# EasyEDA Pro project ProPrj_HydroNodeStation01_2026-04-19.epro, schematic WIOE5Board
Board Name: Board1; Create Date: 2026-03-25; Page Name: P1; Project Name: HydroNodeStation01; Schematic Name: Schematic1; Update Date: 2026-03-31; Company: EasyEDA.com; Page Size: A4; Version: V1.0
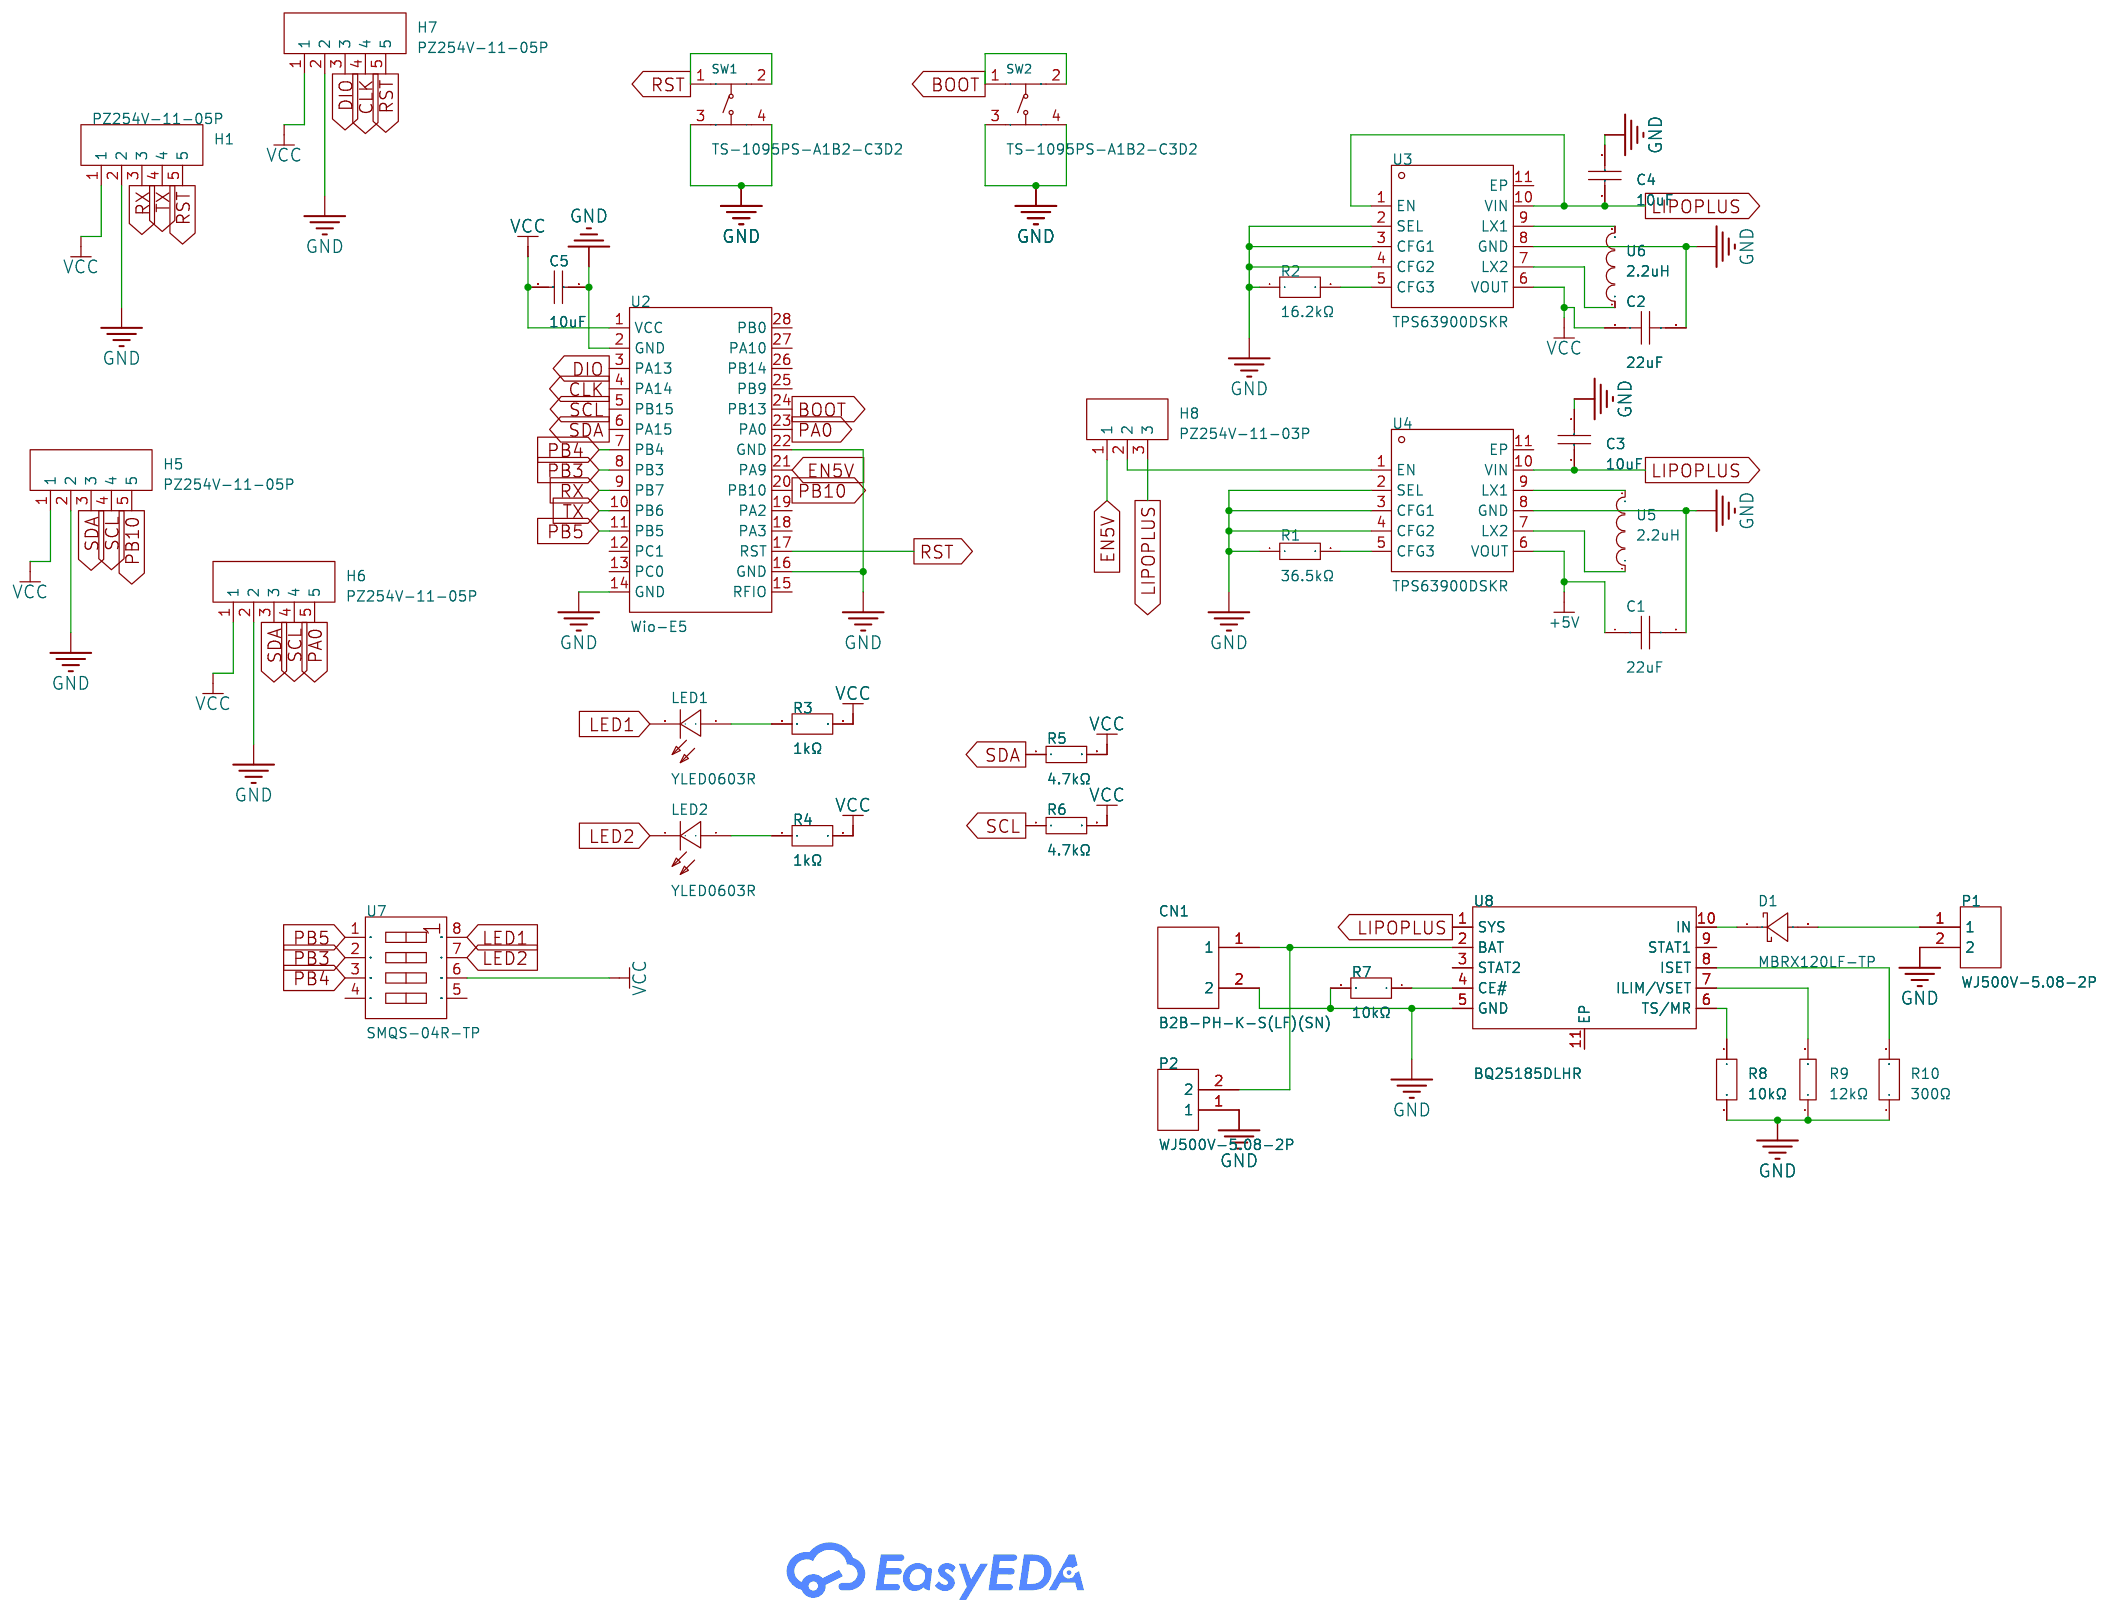
[diagram p1: schematic sheet]

## Parts
C1  22uF  [C0603]
C2  22uF  [C0603]
C3  10uF  [C0402]
C4  10uF  [C0402]
C5  10uF  [C0402]
CN1  B2B-PH-K-S(LF)(SN)  [CONN-TH_B2B-PH-K-S]
D1  MBRX120LF-TP  [SOD-123_L2.7-W1.6-LS3.7-RD]
H1  PZ254V-11-05P  [HDR-TH_5P-P2.54-V-M]
H5  PZ254V-11-05P  [HDR-TH_5P-P2.54-V-M]
H6  PZ254V-11-05P  [HDR-TH_5P-P2.54-V-M]
H7  PZ254V-11-05P  [HDR-TH_5P-P2.54-V-M]
H8  PZ254V-11-03P  [HDR-TH_3P-P2.54-V-M_PZ254V-11-03P]
LED1  YLED0603R  [LED0603-FD]
LED2  YLED0603R  [LED0603-FD]
P1  WJ500V-5.08-2P  [CONN-TH_2P-P5.00_WJ500V-5.08-2P]
P2  WJ500V-5.08-2P  [CONN-TH_2P-P5.00_WJ500V-5.08-2P]
R1  36.5kΩ  [R0402]
R2  16.2kΩ  [R0402]
R3  1kΩ  [R0402]
R4  1kΩ  [R0402]
R5  4.7kΩ  [R0603]
R6  4.7kΩ  [R0603]
R7  10kΩ  [R0805]
R8  10kΩ  [R0805]
R9  12kΩ  [R0402]
R10  300Ω  [R0603]
SW1  TS-1095PS-A1B2-C3D2  [KEY-SMD_4P-L6.0-W6.0-P3.90-LS9.0]
SW2  TS-1095PS-A1B2-C3D2  [KEY-SMD_4P-L6.0-W6.0-P3.90-LS9.0]
U2  Wio-E5  [COMM-SMD_L12.0-W12.0-P1.25_114993120]
U3  TPS63900DSKR  [WSON-10_L2.5-W2.5-W0.50-TL-EP]
U4  TPS63900DSKR  [WSON-10_L2.5-W2.5-W0.50-TL-EP]
U5  2.2uH  [IND-SMD_L3.0-W3.0_LVF303012-4R7M-N]
U6  2.2uH  [IND-SMD_L3.0-W3.0_LVF303012-4R7M-N]
U7  SMQS-04R-TP  [SW-TH_8P-P2.54_SMQS-04R-TP]
U8  BQ25185DLHR  [WSON-10_L2.2-W2.0-P0.40-BL-EP_TI_DLH0010A]

## Library data of the parts
C1 C2 = CL10A226MQ8NRNC: Capacitance:22uF Tolerance:±20% Tolerance:±20% Voltage Rating:6.3V Temperature Coefficient:X5R; LCSC Part Name: 22uF ±20% 6.3V; Supplier Part: C59461; Manufacturer: SAMSUNG(三星); Supplier Footprint: 0603; JLCPCB Part Class: Basic Part; Datasheet: https://item.szlcsc.com/datasheet/CL10A226MQ8NRNC/60514.html; Supplier: LCSC; Tolerance: ±20%; Voltage Rating: 6.3V; Temperature Coefficient: X5R
C3-C5 = CL05A106MQ5NUNC: Capacitance:10uF Tolerance:±20% Tolerance:±20% Voltage Rating:6.3V Temperature Coefficient:X5R; LCSC Part Name: 10uF ±20% 6.3V; Supplier Part: C15525; Manufacturer: SAMSUNG(三星); Supplier Footprint: 0402; JLCPCB Part Class: Basic Part; Datasheet: https://item.szlcsc.com/datasheet/CL05A106MQ5NUNC/16204.html; Supplier: LCSC; Tolerance: ±20%; Voltage Rating: 6.3V; Temperature Coefficient: X5R
CN1 = B2B-PH-K-S(LF)(SN): Pins Structure:1x2P Pitch:2mm Mounting Type:Through Hole Reference Series:PH Number of Pins:2P Number of Rows:1 Number of PINs Per Row:2 Row Spacing:- Current Rating:2A Contact Material:Brass Contact Plating:Tin Operating Temperature:-25℃~+85℃ Operating T; LCSC Part Name: 1x2P 间距:2mm 直插 系列:PH; Supplier Part: C131337; Manufacturer: JST; Supplier Footprint: 插件,P=2mm; JLCPCB Part Class: Extended Part; Datasheet: https://item.szlcsc.com/datasheet/B2B-PH-K-S(LF)(SN)/142630.html; Supplier: LCSC; Pins Structure: 1x2P; Pitch: 2mm; Mounting Type: Through Hole; Reference Series: PH; Number of Pins: 2P; Number of Rows: 1; Number of PINs Per Row: 2; Current Rating: 2A; Contact Material: Brass; Contact Plating: Tin; Operating Temperature: -25℃~+85℃; Voltage Rating: 100V; Plastic Material: PA66; Flame Retardant Rating: UL94V-0; Supplementary Features: K Pin; Color: White; Z-Height of the Board: 6mm; X-Length of Bottom Edge on Board (Spacing Line): 5.9mm; Y-Width of Bottom Edge on Board: 4.5mm
D1 = MBRX120LF-TP: Diode Configuration:- Voltage - Forward(Vf@If):320mV@1A Voltage - DC Reverse(Vr):20V Current - Rectified:1A Reverse Leakage Current (Ir):260uA@5V Operating Junction Temperature Range:-65℃~+125℃ Operating Junction Temperature Range:-65℃~+125℃ Non-Repetitiv; LCSC Part Name: 电压:20V 电流:1A; Supplier Part: C668956; Manufacturer: MCC(美微科); Supplier Footprint: SOD-123; JLCPCB Part Class: Extended Part; Datasheet: https://item.szlcsc.com/datasheet/MBRX120LF-TP/699015.html; Supplier: LCSC; Voltage - Forward(Vf@If): 320mV@1A; Voltage - DC Reverse(Vr): 20V; Current - Rectified: 1A; Reverse Leakage Current (Ir): 260uA@5V; Operating Junction Temperature Range: -65℃~+125℃; Non-Repetitive Peak Forward Surge Current: 12A
H1 H5-H7 = PZ254V-11-05P: Pin Structure:1x5P Pitch:2.54mm Row Spacing:- Circluar Pins/Square Pins:Pin Header Mounting Type:Through Hole Number of Rows:1 Number of Pins:5P Current Rating:3A Voltage Rating (Max):250V Length of Mating Pin:6mm Insulation Height:2.5mm Length of End Con; LCSC Part Name: 1x5P 间距:2.54mm 方针 直插; Supplier Part: C492404; Manufacturer: XFCN(兴飞); Supplier Footprint: 插件,P=2.54mm; JLCPCB Part Class: Extended Part; Datasheet: https://item.szlcsc.com/datasheet/PZ254V-11-05P/502960.html; Supplier: LCSC; Pin Structure: 1x5P; Pitch: 2.54mm; Circluar Pins/Square Pins: Pin Header; Mounting Type: Through Hole; Number of Rows: 1; Number of Pins: 5P; Current Rating: 3A; Voltage Rating (Max): 250V; Length of Mating Pin: 6mm; Insulation Height: 2.5mm; Length of End Connection Pin: 3mm; Contact Material: Brass; Operating Temperature: -40℃~+105℃; Color: Black
H8 = PZ254V-11-03P: Pin Structure:1x3P Pitch:2.54mm Row Spacing:- Circluar Pins/Square Pins:Pin Header Mounting Type:Through Hole Number of Rows:1 Number of Pins:3P Current Rating:3A Voltage Rating (Max):250V Length of Mating Pin:6mm Insulation Height:2.5mm Length of End Con; LCSC Part Name: 1x3P 间距:2.54mm 方针 直插; Supplier Part: C2937625; Manufacturer: XFCN(兴飞); Supplier Footprint: 插件,P=2.54mm; JLCPCB Part Class: Extended Part; Datasheet: https://item.szlcsc.com/datasheet/PZ254V-11-03P/3293280.html; Supplier: LCSC; Pin Structure: 1x3P; Pitch: 2.54mm; Circluar Pins/Square Pins: Pin Header; Mounting Type: Through Hole; Number of Rows: 1; Number of Pins: 3P; Current Rating: 3A; Voltage Rating (Max): 250V; Length of Mating Pin: 6mm; Insulation Height: 2.5mm; Length of End Connection Pin: 3mm; Operating Temperature: -40℃~+105℃; Color: Black
LED1 LED2 = YLED0603R: Lamp Holder Type:-；- Illumination Color:Red Voltage - Forward(Vf):1.8V~2.4V Voltage - Forward(Vf):1.8V~2.4V Power(Watts):- Forward Current:25mA Wavelength - Dominant:620nm~625nm Wavelength - Dominant:620nm~625nm Peak Wavelength:- Diode Configuration:Discr; LCSC Part Name: 红色 独立二极管; Supplier Part: C19171390; Manufacturer: YONGYUTAI(永裕泰); Supplier Footprint: 0603; JLCPCB Part Class: Extended Part; Datasheet: https://item.szlcsc.com/datasheet/YLED0603R/20382441.html; Supplier: LCSC; Lamp Holder Type: -；-; Illumination Color: Red; Voltage - Forward(Vf): 1.8V~2.4V; Forward Current: 25mA; Wavelength - Dominant: 620nm~625nm; Diode Configuration: Discrete Diode; Luminous Intensity: 120mcd; Viewing Angle: 120°; Operating Temperature: -40℃~+85℃
P1 P2 = WJ500V-5.08-2P: Structure:1x2P Pitch:5.08mm Color:Green Mounting Style:Direct Insert Current Rating (Max):18A Voltage Rating (Max):250V Number of Pins:2P Number of Rows:1 Wire Gauge - AWG:14~30 Wire Gauge - AWG:14~30 Wire Gauge - mm2:2.5 Wire Gauge - mm2:2.5 Number of PI; LCSC Part Name: 1x2P 5.08mm 直插 排数:1 每排P数:2; Supplier Part: C8465; Manufacturer: KANGNEX(康奈克斯电气); Supplier Footprint: 插件,P=5.08mm; JLCPCB Part Class: Extended Part; Datasheet: https://atta.szlcsc.com/upload/public/pdf/source/20191225/C8465_02D34CE5B5B4A53DF5891601D97FA9F4.pdf; Supplier: LCSC; Structure: 1x2P; Pitch: 5.08mm; Color: Green; Mounting Style: Direct Insert; Current Rating (Max): 18A; Voltage Rating (Max): 250V; Number of Pins: 2P; Number of Rows: 1; Wire Gauge - AWG: 14~30; Wire Gauge - mm2: 2.5; Number of PINs Per Row: 2; Operating Temperature Range: -40℃~+105℃; Screw Specification: M2.5
R1 = 0402WGF3652TCE: Type:Thick Film Resistor Resistance:36.5kΩ Tolerance:±1% Tolerance:±1% Power(Watts):62.5mW Voltage-Supply(Max):50V Temperature Coefficient:±100ppm/℃ Temperature Coefficient:±100ppm/℃ Operating Temperature:-55℃~+155℃ Operating Temperature:-55℃~+155℃; LCSC Part Name: 36.5kΩ ±1% 62.5mW 厚膜电阻; Supplier Part: C25887; Manufacturer: UNI-ROYAL(厚声); Supplier Footprint: 0402; JLCPCB Part Class: Extended Part; Datasheet: https://item.szlcsc.com/datasheet/0402WGF3652TCE/26630.html; Supplier: LCSC; Type: Thick Film Resistor; Tolerance: ±1%; Power(Watts): 62.5mW; Voltage-Supply(Max): 50V; Temperature Coefficient: ±100ppm/℃; Operating Temperature: -55℃~+155℃
R2 = FRC0402F1622TS: Type:Thick Film Resistor Resistance:16.2kΩ Tolerance:±1% Tolerance:±1% Power(Watts):62.5mW Voltage-Supply(Max):50V Temperature Coefficient:±100ppm/℃ Temperature Coefficient:±100ppm/℃ Operating Temperature:-55℃~+155℃ Operating Temperature:-55℃~+155℃; LCSC Part Name: 厚膜电阻 0402 16.2KΩ ±1% 62.5mW; Supplier Part: C49196904; Manufacturer: FOJAN(富捷); Supplier Footprint: 0402; JLCPCB Part Class: Extended Part; Datasheet: https://item.szlcsc.com/datasheet/FRC0402F1622TS/51599152.html; Supplier: LCSC; Type: Thick Film Resistor; Tolerance: ±1%; Power(Watts): 62.5mW; Voltage-Supply(Max): 50V; Temperature Coefficient: ±100ppm/℃; Operating Temperature: -55℃~+155℃
R3 R4 = FRC0402J102 TS: Type:Thick Film Resistor Resistance:1kΩ Tolerance:±5% Tolerance:±5% Power(Watts):62.5mW Voltage-Supply(Max):50V Temperature Coefficient:±100ppm/℃ Temperature Coefficient:±100ppm/℃ Operating Temperature:-55℃~+155℃ Operating Temperature:-55℃~+155℃; LCSC Part Name: 1kΩ ±5% 62.5mW 厚膜电阻; Supplier Part: C2906899; Manufacturer: FOJAN(富捷); Supplier Footprint: 0402; JLCPCB Part Class: Extended Part; Supplier: LCSC; Type: Thick Film Resistor; Tolerance: ±5%; Power(Watts): 62.5mW; Voltage-Supply(Max): 50V; Temperature Coefficient: ±100ppm/℃; Operating Temperature: -55℃~+155℃
R5 R6 = 0603WAF4701T5E: Type:Thick Film Resistor Resistance:4.7kΩ Tolerance:±1% Tolerance:±1% Power(Watts):100mW Voltage-Supply(Max):75V Temperature Coefficient:±100ppm/℃ Temperature Coefficient:±100ppm/℃ Operating Temperature:-55℃~+155℃ Operating Temperature:-55℃~+155℃; LCSC Part Name: 4.7kΩ ±1% 100mW 厚膜电阻; Supplier Part: C23162; Manufacturer: UNI-ROYAL(厚声); Supplier Footprint: 0603; JLCPCB Part Class: Basic Part; Datasheet: https://item.szlcsc.com/datasheet/0603WAF4701T5E/23889.html; Supplier: LCSC; Type: Thick Film Resistor; Tolerance: ±1%; Power(Watts): 100mW; Voltage-Supply(Max): 75V; Temperature Coefficient: ±100ppm/℃; Operating Temperature: -55℃~+155℃
R7 R8 = FRC0805J103TS: Type:Thick Film Resistor Resistance:10kΩ Tolerance:±5% Tolerance:±5% Power(Watts):125mW Voltage-Supply(Max):150V Temperature Coefficient:±100ppm/℃ Temperature Coefficient:±100ppm/℃ Operating Temperature:-55℃~+155℃ Operating Temperature:-55℃~+155℃; LCSC Part Name: 10kΩ ±5% 125mW 厚膜电阻; Supplier Part: C2930231; Manufacturer: FOJAN(富捷); Supplier Footprint: 0805; JLCPCB Part Class: Extended Part; Supplier: LCSC; Type: Thick Film Resistor; Tolerance: ±5%; Power(Watts): 125mW; Voltage-Supply(Max): 150V; Temperature Coefficient: ±100ppm/℃; Operating Temperature: -55℃~+155℃
R9 = 0402WGF1202TCE: Type:Thick Film Resistor Resistance:12kΩ Tolerance:±1% Tolerance:±1% Power(Watts):62.5mW Voltage-Supply(Max):50V Temperature Coefficient:±100ppm/℃ Temperature Coefficient:±100ppm/℃ Operating Temperature:-55℃~+155℃ Operating Temperature:-55℃~+155℃; LCSC Part Name: 12kΩ ±1% 62.5mW 厚膜电阻; Supplier Part: C25752; Manufacturer: UNI-ROYAL(厚声); Supplier Footprint: 0402; JLCPCB Part Class: Basic Part; Datasheet: https://item.szlcsc.com/datasheet/0402WGF1202TCE/26495.html; Supplier: LCSC; Type: Thick Film Resistor; Tolerance: ±1%; Power(Watts): 62.5mW; Voltage-Supply(Max): 50V; Temperature Coefficient: ±100ppm/℃; Operating Temperature: -55℃~+155℃
R10 = FRC0603J301 TS: Type:Thick Film Resistor Resistance:300Ω Tolerance:±5% Tolerance:±5% Power(Watts):100mW Voltage-Supply(Max):75V Temperature Coefficient:±100ppm/℃ Temperature Coefficient:±100ppm/℃ Operating Temperature:-55℃~+155℃ Operating Temperature:-55℃~+155℃; LCSC Part Name: 300Ω ±5% 100mW 厚膜电阻; Supplier Part: C2907148; Manufacturer: FOJAN(富捷); Supplier Footprint: 0603; JLCPCB Part Class: Extended Part; Supplier: LCSC; Type: Thick Film Resistor; Tolerance: ±5%; Power(Watts): 100mW; Voltage-Supply(Max): 75V; Temperature Coefficient: ±100ppm/℃; Operating Temperature: -55℃~+155℃
SW1 SW2 = TS-1095PS-A1B2-C3D2: Circuit:SPST Actuator Style:Round Button Operating Force:1.8N Mounting Type:Surface Mount,Vertical Length:6mm Width:6mm Switch Height:4.3mm with Bracket:Without Bracket Actuator/Cap Color:Black Termination Style:Gull Wing Life:-; LCSC Part Name: 6*6*4.3mm 立贴 轻触开关; Supplier Part: C2834918; Manufacturer: Yuandi(元迪); Supplier Footprint: SMD-4P,6x6mm; JLCPCB Part Class: Extended Part; Datasheet: https://item.szlcsc.com/datasheet/TS-1095PS-A1B2-C3D2/2997598.html; Supplier: LCSC; Circuit: SPST; Actuator Style: Round Button; Operating Force: 1.8N; Mounting Type: Surface Mount,Vertical; Length: 6mm; Width: 6mm; Switch Height: 4.3mm; with Bracket: Without Bracket; Actuator/Cap Color: Black; Termination Style: Gull Wing
U2 = Wio-E5: Supplier Part: C9900154730; Supplier Footprint: LCC-28_12x12mm; JLCPCB Part Class: Extended Part; Supplier: LCSC
U3 U4 = TPS63900DSKR: Input Voltage:1.8V~5.5V Input Voltage:1.8V~5.5V Output Current:400mA Switching Frequency:- Switching Frequency:- Operating Temperature:-40℃~+125℃@(TJ) Operating Temperature:-40℃~+125℃@(TJ) Synchronous Rectification:Yes Number of Outputs:- Topology:Step-do; LCSC Part Name: 1.8V至5.5V,75nA超低静态电流同步升降压转换器; Supplier Part: C1518762; Manufacturer: TI(德州仪器); Supplier Footprint: WSON-10-EP(2.5x2.5); JLCPCB Part Class: Extended Part; Datasheet: https://www.ti.com/cn/lit/gpn/tps63900; Supplier: LCSC; Input Voltage: 1.8V~5.5V; Output Current: 400mA; Operating Temperature: -40℃~+125℃@(TJ); Synchronous Rectification: Yes; Topology: Step-down-Boost
U5 U6 = SRN3015-2R2M: Inductance:2.2uH Tolerance:±20% Tolerance:±20% Current Rating:1.8A Current - Saturation(Isat):1.65A DC Resistance(DCR):72mΩ Type:Magnetic Shielded Inductor Ratings:-; LCSC Part Name: 2.2uH ±20% 1.65A; Supplier Part: C2041716; Manufacturer: BOURNS; Supplier Footprint: SMD,3x3mm; JLCPCB Part Class: Extended Part; Datasheet: https://item.szlcsc.com/datasheet/SRN3015-2R2M/2133279.html; Supplier: LCSC; Tolerance: ±20%; Current Rating: 1.8A; Current - Saturation(Isat): 1.65A; DC Resistance(DCR): 72mΩ; Type: Magnetic Shielded Inductor
U7 = SMQS-04R-TP: Type:Slide, Rocked Circuit:- Number of Positions:4 Termination Style:- Lead Pitch:2.54mm Current Rating:- Voltage Rating:- Operating Temperature:-40℃~+85℃ Operating Temperature:-40℃~+85℃ Operating Life:5000 Cycles Color:Red; LCSC Part Name: 间距2.54mm 平拨,凸起式4位拨码开关; Supplier Part: C5299505; Manufacturer: SM Switch; Supplier Footprint: 插件,P=2.54mm; JLCPCB Part Class: Extended Part; Datasheet: https://item.szlcsc.com/datasheet/SMQS-04R-TP/6048193.html; Supplier: LCSC; Type: Slide, Rocked; Number of Positions: 4; Lead Pitch: 2.54mm; Operating Temperature: -40℃~+85℃; Operating Life: 5000 Cycles; Color: Red
U8 = BQ25185DLHR: The Chip Type:Charging IC Voltage - Supply:3V~18V Voltage - Supply:3V~18V Charge Current - Max:1A Charging Saturation Voltage:4.4V End-Off Voltage:2.2V Type of Battery:Lithium Battery；LiFePO4 Battery Number of Cells:1 Number of Cells:1 Operating Temperatu; LCSC Part Name: 单节1A独立线性电池充电器，具备电源路径、工厂模式和电池跟踪功能; Supplier Part: C19725033; Manufacturer: TI(德州仪器); Supplier Footprint: WSON-10-EP(2.2x2); JLCPCB Part Class: Extended Part; Datasheet: https://www.ti.com.cn/cn/lit/ds/symlink/bq25185.pdf?ts=1739415017761&ref_url=https%253A%252F%252Fwww.ti.com.cn%252Fproduct%252Fcn%252FBQ25185%253FkeyMatch%253Dbq25185%2526tisearch%253Duniversal_search; Supplier: LCSC; The Chip Type: Charging IC; Voltage - Supply: 3V~18V; Charge Current - Max: 1A; Charging Saturation Voltage: 4.4V; End-Off Voltage: 2.2V; Type of Battery: Lithium Battery；LiFePO4 Battery; Number of Cells: 1; Operating Temperature: -40℃~+125℃; Battery Temperature Detection: Support; Supply Current (Iq): 4uA

## Nets
+5V: C1.1 U4.6(VOUT)
GND: C1.2 C2.2 C3.2 C4.2 C5.1 CN1.2 H1.2 H5.2 H6.2 H7.2 P1.2 P2.1 R1.1 R2.1 R7.2 R8.2 R9.1 R10.1 SW1.3 SW1.4 SW2.3 SW2.4 U2.2(GND) U2.14(GND) U2.16(GND) U2.22(GND) U3.2(SEL) U3.3(CFG1) U3.4(CFG2) U3.8(GND) U4.2(SEL) U4.3(CFG1) U4.4(CFG2) U4.8(GND) U8.5(GND)
VCC: C2.1 C5.2 H1.1 H5.1 H6.1 H7.1 R3.2 R4.2 R5.2 R6.2 U2.1(VCC) U3.6(VOUT) U7.6(PIN6)
BOOT: SW2.1 SW2.2 U2.24(PB13)
CLK: H7.4 U2.4(PA14)
DIO: H7.3 U2.3(PA13)
EN5V: H8.1 U2.21(PA9)
LED1: LED1.2(-) U7.8(PIN8)
LED2: LED2.2(-) U7.7(PIN7)
LIPOPLUS: C3.1 C4.1 H8.3 U3.1(EN) U3.10(VIN) U4.10(VIN) U8.1(SYS)
PA0: H6.5 U2.23(PA0)
PB3: U2.8(PB3) U7.2(PIN2)
PB4: U2.7(PB4) U7.3(PIN3)
PB5: U2.11(PB5) U7.1(PIN1)
PB10: H5.5 U2.20(PB10)
RST: H1.5 H7.5 SW1.1 SW1.2 U2.17(RST)
RX: H1.3 U2.9(PB7)
SCL: H5.4 H6.4 R6.1 U2.5(PB15)
SDA: H5.3 H6.3 R5.1 U2.6(PA15)
TX: H1.4 U2.10(PB6)
$1N3315: U3.7(LX2) U6.1
$1N3324: U3.9(LX1) U6.2
$1N3329: U4.9(LX1) U5.2
$1N3333: U4.7(LX2) U5.1
$1N3893: R1.2 U4.5(CFG3)
$1N3996: R2.2 U3.5(CFG3)
$1N4260: H8.2 U4.1(EN)
$1N5487: LED1.1(+) R3.1
$1N5489: LED2.1(+) R4.1
$1N6354: CN1.1 P2.2 U8.2(BAT)
$1N6531: R7.1 U8.4(CE#)
$1N6619: D1.1(K) U8.10(IN)
$1N6623: D1.2(A) P1.1
$1N6664: R8.1 U8.6(TS/MR)
$1N6768: R9.2 U8.7(ILIM/VSET)
$1N6858: R10.2 U8.8(ISET)

Not connected (* = marked no-connect by the designer): U2 12(PC1) 13(PC0) 15(RFIO) 18(PA3) 19(PA2) 25(PB9) 26(PB14) 27(PA10) 28(PB0); U3 11(EP); U4 11(EP); U7 4(PIN4) 5(PIN5); U8 3(STAT2) 9(STAT1) 11(EP)
